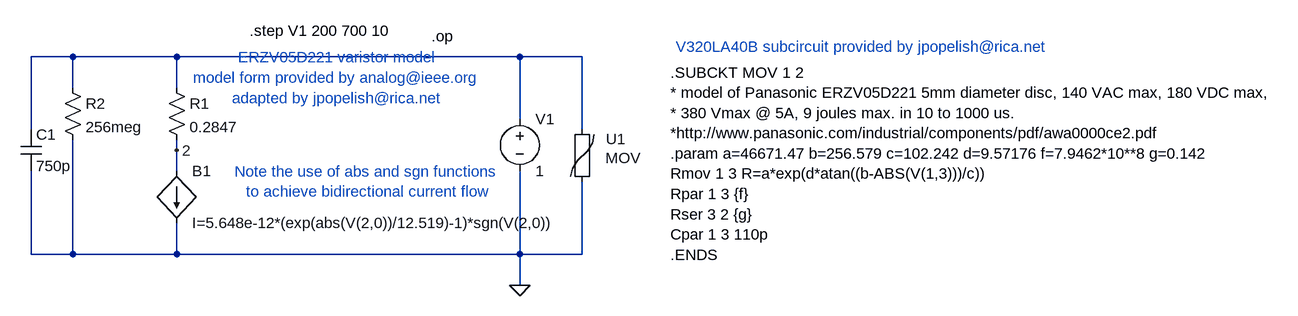
[diagram p0: schematic ERZV05D221x2.asc]
ERZV05D221x2.asc, the LTspice schematic file:
Version 4
SHEET 1 2108 680
WIRE -96 128 -96 16
WIRE -96 320 -96 192
WIRE -32 16 -96 16
WIRE -32 64 -32 16
WIRE -32 320 -96 320
WIRE -32 320 -32 144
WIRE 128 16 -32 16
WIRE 128 64 128 16
WIRE 128 160 128 144
WIRE 128 192 128 160
WIRE 128 320 -32 320
WIRE 128 320 128 272
WIRE 656 16 128 16
WIRE 656 112 656 16
WIRE 656 320 128 320
WIRE 656 320 656 192
WIRE 656 368 656 320
WIRE 752 16 656 16
WIRE 752 128 752 16
WIRE 752 320 656 320
WIRE 752 320 752 208
FLAG 656 368 0
FLAG 128 160 2
SYMBOL bi 128 192 R0
SYMATTR InstName B1
SYMATTR Value I=5.648e-12*(exp(abs(V(2,0))/12.519)-1)*sgn(V(2,0))
SYMBOL res 112 48 R0
SYMATTR InstName R1
SYMATTR Value 0.2847
SYMBOL cap -112 128 R0
SYMATTR InstName C1
SYMATTR Value 750p
SYMBOL voltage 656 96 R0
WINDOW 123 0 0 Left 0
WINDOW 39 0 0 Left 0
SYMATTR InstName V1
SYMATTR Value 1
SYMBOL MOV 736 112 R0
SYMATTR InstName U1
SYMBOL res -48 48 R0
SYMATTR InstName R2
SYMATTR Value 256meg
TEXT 376 48 Center 0 ;ERZV05D221 varistor model\nmodel form provided by analog@ieee.org\nadapted by jpopelish@rica.net
TEXT 424 208 Center 0 ;Note the use of abs and sgn functions \nto achieve bidirectional current flow
TEXT 520 -16 Left 0 !.op
TEXT 240 -24 Left 0 !.step V1 200 700 10
TEXT 888 40 Left 0 !.SUBCKT MOV 1 2\n* model of Panasonic ERZV05D221 5mm diameter disc, 140 VAC max, 180 VDC max, \n* 380 Vmax @ 5A, 9 joules max. in 10 to 1000 us. \n*http://www.panasonic.com/industrial/components/pdf/awa0000ce2.pdf\n.param a=46671.47 b=256.579 c=102.242 d=9.57176 f=7.9462*10**8 g=0.142\nRmov 1 3 R=a*exp(d*atan((b-ABS(V(1,3)))/c))\nRpar 1 3 {f}\nRser 3 2 {g}\nCpar 1 3 110p\n.ENDS
TEXT 896 0 Left 0 ;V320LA40B subcircuit provided by jpopelish@rica.net

The netlist it stands for:
* ERZV05D221x2.asc
B1 2 0 I=5.648e-12*(exp(abs(V(2,0))/12.519)-1)*sgn(V(2,0))
R1 N001 2 0.2847
C1 N001 0 750p
V1 N001 0 1
XU1 N001 0 MOV  ; pins A B
R2 N001 0 256meg
* ERZV05D221 varistor model
* model form provided by analog@ieee.org
* adapted by jpopelish@rica.net
* Note the use of abs and sgn functions
* to achieve bidirectional current flow
.op
.step V1 200 700 10
.SUBCKT MOV 1 2
* model of Panasonic ERZV05D221 5mm diameter disc, 140 VAC max, 180 VDC max,
* 380 Vmax @ 5A, 9 joules max. in 10 to 1000 us.
*http://www.panasonic.com/industrial/components/pdf/awa0000ce2.pdf
.param a=46671.47 b=256.579 c=102.242 d=9.57176 f=7.9462*10**8 g=0.142
Rmov 1 3 R=a*exp(d*atan((b-ABS(V(1,3)))/c))
Rpar 1 3 {f}
Rser 3 2 {g}
Cpar 1 3 110p
.ENDS
* V320LA40B subcircuit provided by jpopelish@rica.net
.backanno
.end